# Altium schematic sheet 5V_DCDC_Conv.SchDoc
size A; SheetNumber: 12; SheetTotal: 15
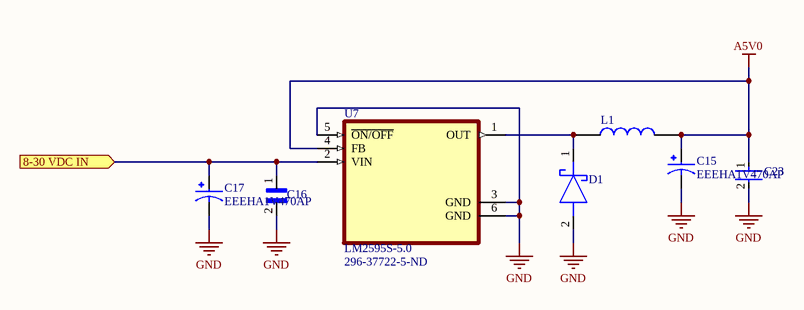
[diagram p0: 5V_DCDC_Conv.SchDoc]

## Parts
C15  EEEHA1V470AP  [CAP_EEEHA1V470AP]
C16  C0805C104M5UACTU  [CAPC2012X88N]  (value not drawn)
C17  EEEHA1V470AP  [CAP_EEEHA1V470AP]
C23  C0603C104K5RACTU  [FP-C0603C-CF-IPC_A]  (value not drawn)
D1  SS34-E3_57T  [DIOM7959X262N]  (value not drawn)
L1  LQH3NPH101MMEL  [IND_LQH3NPH101MMEL]  (value not drawn)
U7  LM2595S-5.0  Supplier Part Number 1: 296-37722-5-ND  [VREG_TPS79625KTTR]

## Ports
8-30 VDC IN (in)

## Nets
A5V0: C15.1 C23.1 L1.2 U7.4(FB)
GND: C15.2 C16.2 C17.2 C23.2 D1.2(A) U7.3(GND) U7.5(~{ON/OFF}) U7.6(GND)
8-30 VDC IN: C16.1 C17.1 U7.2(VIN) ; port 8-30 VDC IN
NetD1_1: D1.1(K) L1.1 U7.1(OUT)

## Library data of the parts
C15 C17 = EEEHA1V470AP: 47ÂµF 35V Aluminum Electrolytic Capacitors Radial, Can - SMD 1000 Hrs @ 105Â°C; MF: Panasonic; MP: EEE-HA1V470AP; Price: None; Value: *; Purchase-URL: https://pricing.snapeda.com/search/part/EEE-HA1V470AP/?ref=eda; Check_prices: https://www.snapeda.com/parts/EEE-HA1V470AP/Panasonic/view-part/?ref=eda; Package: RADIAL-2 Panasonic; Availability: In Stock; SnapEDA_Link: https://www.snapeda.com/parts/EEE-HA1V470AP/Panasonic/view-part/?ref=snap
C16 = C0805C104M5UACTU: 0.1ÂµF Â±20% 50V Ceramic Capacitor Z5U 0805 _2012 Metric_; MF: KEMET; SnapEDA_Link: https://www.snapeda.com/parts/C0805C104M5UACTU/KEMET/view-part/455200/?ref=snap; Availability: Unavailable; Price: None; Package: 2012 KEMET; Value: *; MP: C0805C104M5UACTU; Supplier 1: Mouser; Supplier Part Number 1: 80-C0805C104Z5V
C23 = C0603C104K5RACTU: Multilayer Ceramic Capacitors (MLCC) - SMD/SMT 50volts 0.1uF X7R 10%; Manufacturer: KEMET; Voltage Rating (DC): 50V; Capacitance: 100nF; Dissipation Factor: 2.5%; Supplier 1: Digi-Key; Manufacturer Part Number: C0603C104K5RACTU; RoHS: Yes; Category: Ceramic Capacitors; Pricing 1: 1=0.12000, 10=0.08500, 50=0.04620, 100=0.03770, 500=0.02696, 1000=0.02118 (USD); Mount: Surface Mount; Case/Package: 0603; Number of Pins: 2; Case Code (Metric): 1608; Case Code (Imperial): 0603; Dielectric Material: Ceramic; Contact Plating: Tin,Matte; Min Operating Temperature: -55°C; Max Operating Temperature: 125°C; Tolerance: 10%; Voltage Rating: 50V; Packaging: Tape and Reel; Package Quantity: 1; Dielectric: X7R; Termination: SMD/SMT; Voltage: 50V; Series: SMD Comm X7R; Length: 0.063inch; Width: 0.031inch; Height: 0.8mm; Thickness: 0.034inch; Depth: 0.8mm; Lead Pitch: 0.7mm; Radiation Hardening: No; REACH SVHC: No SVHC; RoHS Compliant: Yes; ComponentLink1URL: https://datasheet.ciiva.com/7823/kem-c1002-x7r-smd-7823591.pdf?src-supplier=Element14; ComponentLink1Description: https://datasheet.ciiva.com/7823/kem-c1002-x7r-smd-7823591.pdf?src-supplier=Element14; ComponentLink2URL: https://datasheet.ciiva.com/7823/kem-c1002-x7r-smd-7823592.pdf?src-supplier=Element14; ComponentLink2Description: https://datasheet.ciiva.com/7823/kem-c1002-x7r-smd-7823592.pdf?src-supplier=Element14; ComponentLink3URL: https://datasheet.ciiva.com/5999/kem-c1002-x7r-smd-5999400.pdf?src-supplier=Farnell; ComponentLink3Description: https://datasheet.ciiva.com/5999/kem-c1002-x7r-smd-5999400.pdf?src-supplier=Farnell; ComponentLink4URL: https://datasheet.ciiva.com/28645/1851736-28645640.pdf?src-supplier=Element14; ComponentLink4Description: https://datasheet.ciiva.com/28645/1851736-28645640.pdf?src-supplier=Element14; ComponentLink5URL: https://datasheet.ciiva.com/14585/70095383-14585209.pdf?src-supplier=Allied+Electronics; ComponentLink5Description: https://datasheet.ciiva.com/14585/70095383-14585209.pdf?src-supplier=Allied+Electronics; ComponentLink6URL: https://datasheet.ciiva.com/14602/70095383-14602583.pdf?src-supplier=Allied+Electronics; ComponentLink6Description: https://datasheet.ciiva.com/14602/70095383-14602583.pdf?src-supplier=Allied+Electronics; Supplier Part Number 1: 399-C0603C104K5RAC7867CT-ND; Stock 1: 10133409
D1 = SS34-E3_57T: Schottky Diode; Manufacturer_Name: Vishay; Manufacturer_Part_Number: SS34-E3/57T; Datasheet Link: https://www.vishay.com/docs/88751/ss32.pdf; Height: 2.62mm; Mouser Part Number: 625-SS34-E3; Mouser Price/Stock: https://www.mouser.co.uk/ProductDetail/Vishay-General-Semiconductor/SS34-E3-57T?qs=x2jpVgRnAtMC3f38kYWnRw%3D%3D; Arrow Part Number: SS34-E3/57T; Arrow Price/Stock: https://www.arrow.com/en/products/ss34-e357t/vishay; Supplier 1: Digi-Key; Supplier Part Number 1: SS34-E3/57TGICT-ND
L1 = LQH3NPH101MMEL: FIXED IND 10UH 1280MA POWRTRNAUT; Package: None; Price: None; Value: *; MP: LQH3NPH101MMEL; Availability: Unavailable; Supplier 1: Mouser; Supplier Part Number 1: 81-LQH3NPH101MMEL
U7 = LM2595S-5.0: SIMPLE SWITCHERé›»æºè½‰æ›å™¨150 KHz 1Aé™å£“ç©©å£“å™¨5-DDPAK / TO-263; MF: Texas Instruments; Price: None; MP: LM2595S-5.0; SnapEDA_Link: https://www.snapeda.com/parts/LM2595S-5.0/Texas%20Instruments/view-part/20758/?ref=snap; Availability: Warning; Value: *; DigiKey-Purchase-URL: https://snapeda.com/shop?store=DigiKey&id=20758; Package: TO-263-5 Texas Instruments; Check_prices: https://www.snapeda.com/parts/LM2595S-5.0/Texas%20Instruments/view-part/20758/?ref=eda; Supplier 1: Digi-Key